# Altium schematic sheet 海关全向控制器主控板电路V2_数传电路.SchDoc
size A4
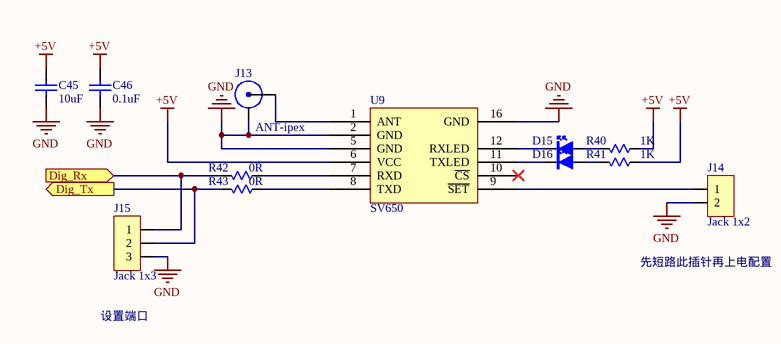
[diagram p0: 海关全向控制器主控板电路V2_数传电路.SchDoc]

## Parts
C45  10uF  [C0603]
C46  0.1uF  [C0603]
D15  LED  [LED0603]  (value not drawn)
D16  LED  [LED0603]  (value not drawn)
J13  ANT-ipex  [IPEX]
J14  Jack 1x2  [HY-2A]
J15  Jack 1x3  [35363-0360]
R40  1K  [R0603]
R41  1K  [R0603]
R42  0R  [R0603]
R43  0R  [R0603]
U9  SV650  [SV650]

## Ports
Dig_Rx (in), Dig_Tx (out)

## Nets
+5V: C45.2 C46.2 R40.1 R41.1 U9.6(VCC)
GND: C45.1 C46.1 J13.2(GND) J14.2 J15.3 U9.2(GND) U9.5(GND) U9.16(GND)
Dig_Rx: J15.1 R42.2 ; port Dig_Rx
Dig_Tx: J15.2 R43.2 ; port Dig_Tx
NetD15_1: D15.1(A) R40.2
NetD15_2: D15.2(K) U9.12(RXLED)
NetD16_1: D16.1(A) R41.2
NetD16_2: D16.2(K) U9.11(TXLED)
NetJ13_1: J13.1(ANT) U9.1(ANT)
NetJ14_1: J14.1 U9.9(~{SET})
NetR42_1: R42.1 U9.7(RXD)
NetR43_1: R43.1 U9.8(TXD)

Not connected (* = marked no-connect by the designer): U9 10(~{CS})*

## Notes on the sheet
- 先短路此插针再上电配置
- 设置端口
- 文件名:
- 审核:
- 制图人:
- 孟浩
- 校对:
- 图号:
- 批准:
- 日期:

## Library data of the parts
C45 C46 = Cap Semi
J14 = Jack 1x2: 插座
J15 = Jack 1x3: 插座
R40-R43 = Res: Resistor; Published: 8-Jun-2000; LatestRevisionDate: 04-Mar-2005; LatestRevisionNote: PCB Footprint replaced.; PackageReference: J1-0603; Publisher: Altium Limited
  R42 R43: Value: 0R